# Altium schematic sheet P06_ESP32S3R8_Core.SchDoc
size A4; SheetNumber: 6; SheetTotal: 7
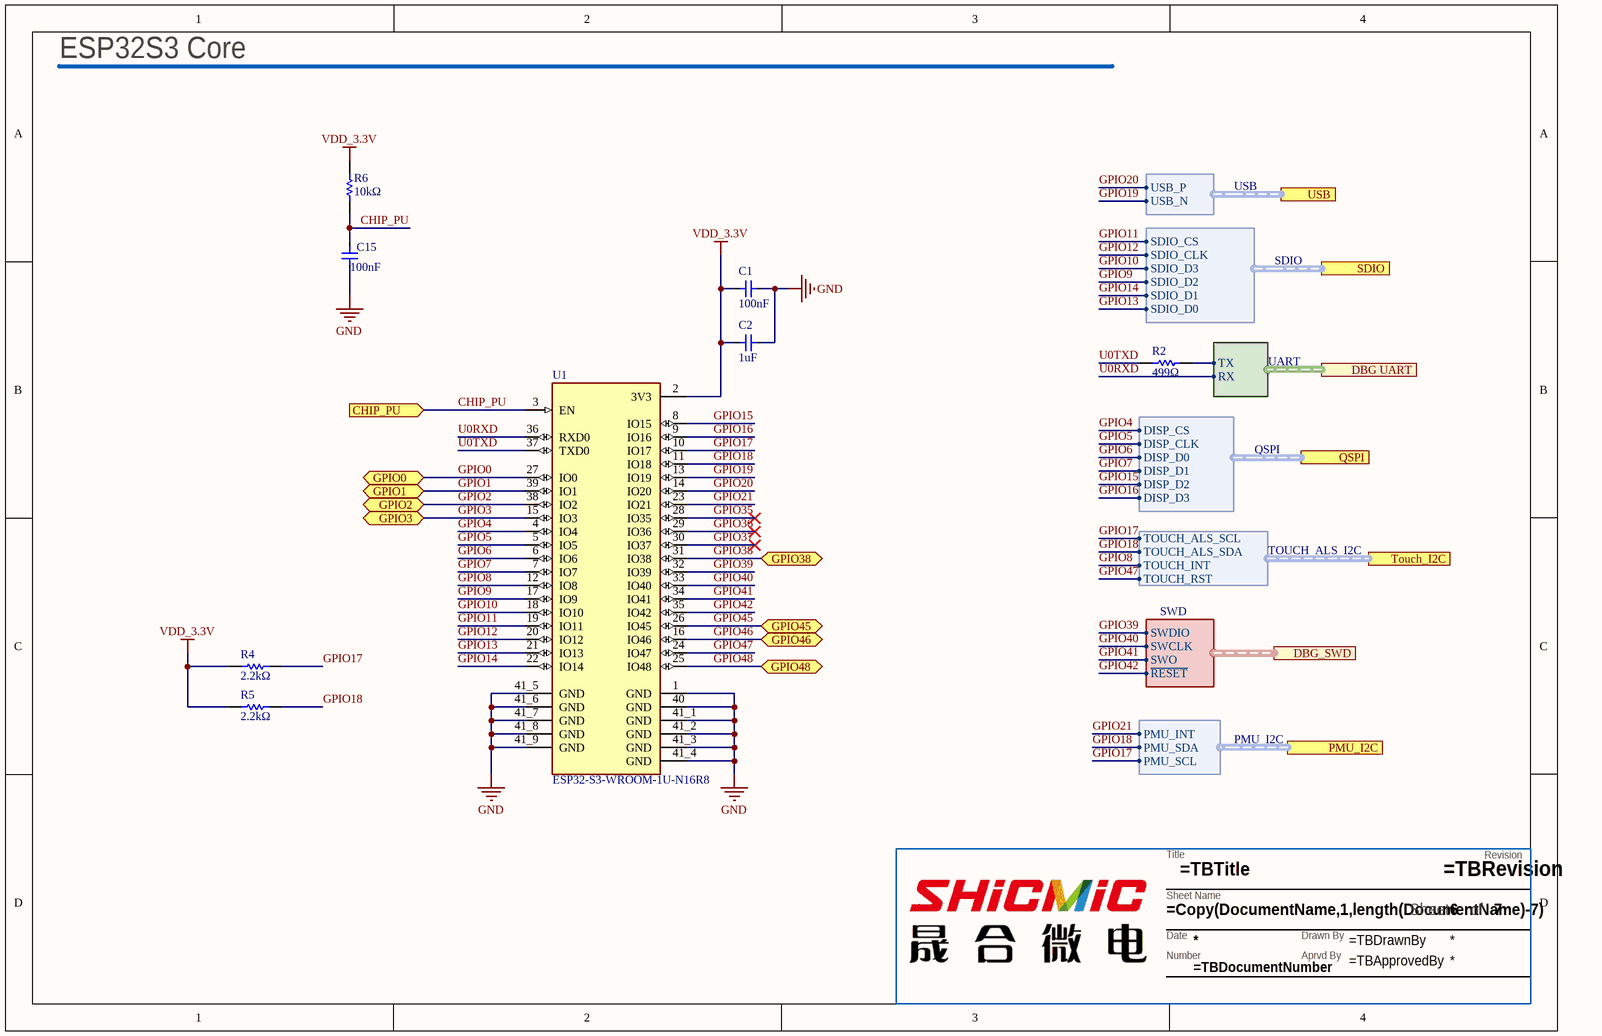
[diagram p0: P06_ESP32S3R8_Core.SchDoc]

## Parts
?  TitleBlock  (value not drawn)  (graphical)
C1  100nF  [CAP_0402]
C2  1uF  [CAP_0402]
C15  100nF  [CAP_0402]
R2  499Ω  [RES_0402]
R4  2.2kΩ  [RES_0402]
R5  2.2kΩ  [RES_0402]
R6  10kΩ  [RES_0402]
U1  ESP32-S3-WROOM-1U-N16R8  [XCVR_ESP32-S3-WROOM-1U-N16R8]

## Ports
CHIP_PU (in), DBG UART (harness UART), DBG_SWD (harness SWD), GPIO0 (bidir), GPIO1 (bidir), GPIO2 (bidir), GPIO3 (bidir), GPIO38 (bidir), GPIO45 (bidir), GPIO46 (bidir), GPIO48 (bidir), PMU_I2C (harness PMU_I2C), QSPI (harness QSPI), SDIO (harness SDIO), Touch_I2C (harness TOUCH_ALS_I2C), USB (harness USB)

## Harnesses
QSPI: DISP_CLK, DISP_CS, DISP_D0, DISP_D1, DISP_D2, DISP_D3
TOUCH_ALS_I2C: TOUCH_ALS_SCL, TOUCH_ALS_SDA, TOUCH_INT, TOUCH_RST
SDIO: SDIO_CLK, SDIO_CS, SDIO_D0, SDIO_D1, SDIO_D2, SDIO_D3
USB: USB_N, USB_P
SWD: SWCLK, SWDIO, SWO, ~{RESET}
UART: TX, RX
PMU_I2C: PMU_SCL, PMU_SDA, PMU_INT

## Nets
GND: C1.2 C2.2 C15.2 U1.1(GND) U1.40(GND) U1.41_1(GND) U1.41_2(GND) U1.41_3(GND) U1.41_4(GND) U1.41_5(GND) U1.41_6(GND) U1.41_7(GND) U1.41_8(GND) U1.41_9(GND)
VDD_3.3V: C1.1 C2.1 R4.1 R5.1 R6.2 U1.2(3V3)
CHIP_PU: C15.1 R6.1 U1.3(EN) ; port CHIP_PU
GPIO0: U1.27(IO0) ; port GPIO0
GPIO1: U1.39(IO1) ; port GPIO1
GPIO2: U1.38(IO2) ; port GPIO2
GPIO3: U1.15(IO3) ; port GPIO3
GPIO4: U1.4(IO4) ; port QSPI.DISP_CS
GPIO5: U1.5(IO5) ; port QSPI.DISP_CLK
GPIO6: U1.6(IO6) ; port QSPI.DISP_D0
GPIO7: U1.7(IO7) ; port QSPI.DISP_D1
GPIO8: U1.12(IO8) ; port Touch_I2C.TOUCH_INT
GPIO9: U1.17(IO9) ; port SDIO.SDIO_D2
GPIO10: U1.18(IO10) ; port SDIO.SDIO_D3
GPIO11: U1.19(IO11) ; port SDIO.SDIO_CS
GPIO12: U1.20(IO12) ; port SDIO.SDIO_CLK
GPIO13: U1.21(IO13) ; port SDIO.SDIO_D0
GPIO14: U1.22(IO14) ; port SDIO.SDIO_D1
GPIO15: U1.8(IO15) ; port QSPI.DISP_D2
GPIO16: U1.9(IO16) ; port QSPI.DISP_D3
GPIO17: R4.2 U1.10(IO17) ; port Touch_I2C.TOUCH_ALS_SCL, port PMU_I2C.PMU_SCL
GPIO18: R5.2 U1.11(IO18) ; port Touch_I2C.TOUCH_ALS_SDA, port PMU_I2C.PMU_SDA
GPIO19: U1.13(IO19) ; port USB.USB_N
GPIO20: U1.14(IO20) ; port USB.USB_P
GPIO21: U1.23(IO21) ; port PMU_I2C.PMU_INT
GPIO35: U1.28(IO35)
GPIO36: U1.29(IO36)
GPIO37: U1.30(IO37)
GPIO38: U1.31(IO38) ; port GPIO38
GPIO39: U1.32(IO39) ; port DBG_SWD.SWDIO
GPIO40: U1.33(IO40) ; port DBG_SWD.SWCLK
GPIO41: U1.34(IO41) ; port DBG_SWD.SWO
GPIO42: U1.35(IO42) ; port DBG_SWD.~{RESET}
GPIO45: U1.26(IO45) ; port GPIO45
GPIO46: U1.16(IO46) ; port GPIO46
GPIO47: U1.24(IO47) ; port Touch_I2C.TOUCH_RST
GPIO48: U1.25(IO48) ; port GPIO48
U0RXD: U1.36(RXD0) ; port DBG UART.RX
U0TXD: R2.1 U1.37(TXD0)
NetR2_2: R2.2 ; port DBG UART.TX

## Notes on the sheet
- ESP32S3 Core
- (in symbol TitleBlock) Revision; Title; Sheet Name; Sheet; of; Date; Drawn By; Number; Aprvd By

## Library data of the parts
? = TitleBlock: Title block for Ambiq Schematics. Please have the following parameters entered in Project>Project Options>Parameters: / TBTitle / TBDocumentNumber / TBRevision / TBDrawnBy / TBApprovedBy; AMBIQ PN: TitleBlock
C1 C15 = Capacitor: NONE; Manufacturer: Samsung; Manufacturer Part Number: CL05A105MP5NNNC; AMBIQ PN: CL05A105KP5NNNC; Capacitance: 1uF; Tolerance: 20%; Voltage Rating: 10V; Dielectric: X5R; Supplier 1: Newark; Supplier Part Number 1: 82AC9184; RoHS: Yes; Category: Ceramic Capacitors; Mount: Surface Mount; Case/Package: 0402; Case Code (Metric): 1005; Case Code (Imperial): 0402; Min Operating Temperature: -55°C; Max Operating Temperature: 85°C; Packaging: Tape and Reel; Voltage Rating (DC): 10V; Series: CL; Construction: Flat; Length: 1mm; Width: 0.02inch; Height: 0.5mm; Thickness: 0.022inch; Depth: 0.5mm; Radiation Hardening: No; Lead Free: Lead Free; RoHS Compliant: Yes; ComponentLink1URL: https://datasheet.ciiva.com/25802/cl05a105mp5nnnc-25802049.pdf?src-supplier=Digi-Key; ComponentLink1Description: https://datasheet.ciiva.com/25802/cl05a105mp5nnnc-25802049.pdf?src-supplier=Digi-Key; Package Quantity: 1
C2 = Capacitor: NONE; Manufacturer: Samsung; Manufacturer Part Number: CL05A105MP5NNNC; AMBIQ PN: CL05A105KP5NNNC; Tolerance: 20%; Voltage Rating: 10V; Dielectric: X5R; Supplier 1: Newark; Supplier Part Number 1: 82AC9184; RoHS: Yes; Category: Ceramic Capacitors; Mount: Surface Mount; Case/Package: 0402; Case Code (Metric): 1005; Case Code (Imperial): 0402; Min Operating Temperature: -55°C; Max Operating Temperature: 85°C; Capacitance: 1uF; Packaging: Tape and Reel; Voltage Rating (DC): 10V; Series: CL; Construction: Flat; Length: 1mm; Width: 0.02inch; Height: 0.5mm; Thickness: 0.022inch; Depth: 0.5mm; Radiation Hardening: No; Lead Free: Lead Free; RoHS Compliant: Yes; ComponentLink1URL: https://datasheet.ciiva.com/25802/cl05a105mp5nnnc-25802049.pdf?src-supplier=Digi-Key; ComponentLink1Description: https://datasheet.ciiva.com/25802/cl05a105mp5nnnc-25802049.pdf?src-supplier=Digi-Key; Package Quantity: 1
R2 R4-R6 = Resistor: Res Thick Film 0402 20K Ohm 1% 1/16W ±100ppm/°C Molded SMD Paper T/R; Manufacturer: Vishay; AMBIQ PN: CRCW040220K0FKED; Resistance: 20kR; Power Rating: 63mW; Voltage Rating: 50V; Supplier 1: Newark; Supplier Part Number 1: 24W2083; Manufacturer Part Number: CRCW040220K0FKED; RoHS: Yes; Category: Chip SMD Resistors; Stock 1: 380000; Pricing 1: 1=0.00600, 10000=0.00600 (USD); Mount: Surface Mount; Case/Package: 0402; Weight: 2.3E-05oz; Case Code (Metric): 1005; Case Code (Imperial): 0402; Contact Plating: Tin; Min Operating Temperature: -55°C; Max Operating Temperature: 155°C; Package Quantity: 10; Packaging: Tape and Reel; Resistor Type: Thick Film; Number of Terminations: 2; Termination: SMD/SMT; Max Power Dissipation: 63mW; Temperature Coefficient: 100ppm/°C; Voltage Rating (DC): 50V; Features: Automotive AEC-Q200; Series: CRCW; Technology: THICK FILM; Construction: Rectangular; Length: 1mm; Width: 0.5mm; Height: 0.35mm; Depth: 0.5mm; Radiation Hardening: No; REACH SVHC: Unknown; Military Standard: Not; Lead Free: Lead Free; RoHS Compliant: Yes; ComponentLink1URL: https://datasheet.ciiva.com/11810/0900766b80d98824-11810023.pdf?src-supplier=RSComponents; ComponentLink1Description: https://datasheet.ciiva.com/11810/0900766b80d98824-11810023.pdf?src-supplier=RSComponents; ComponentLink2URL: https://datasheet.ciiva.com/2463/dcrcwe3-2463139.pdf?src-supplier=Digi-Key; ComponentLink2Description: https://datasheet.ciiva.com/2463/dcrcwe3-2463139.pdf?src-supplier=Digi-Key; ComponentLink3URL: https://datasheet.ciiva.com/2463/dcrcwe3-2463140.pdf?src-supplier=Digi-Key; Tolerance: 1%; Number of Pins: 2; Resistance Tolerance: 1%; Working Voltage: 50V
U1 = ESP32-S3-WROOM-1U-N16R8: Bluetooth, WiFi 802.11b/g/n, Bluetooth v5.0 Transceiver Module 2.4GHz Antenna Not Included, U.FL Surface Mount; MF: Espressif Systems; Package: None; Price: None; Value: *; SnapEDA_Link: https://www.snapeda.com/parts/ESP32-S3-WROOM-1U-N16R8/Espressif+Systems/view-part/?ref=snap; MP: ESP32-S3-WROOM-1U-N16R8; Availability: Unavailable; Check_prices: https://www.snapeda.com/parts/ESP32-S3-WROOM-1U-N16R8/Espressif+Systems/view-part/?ref=eda